# EAGLE schematic Photon_I2C_Shield (EAGLE 7.6.0)
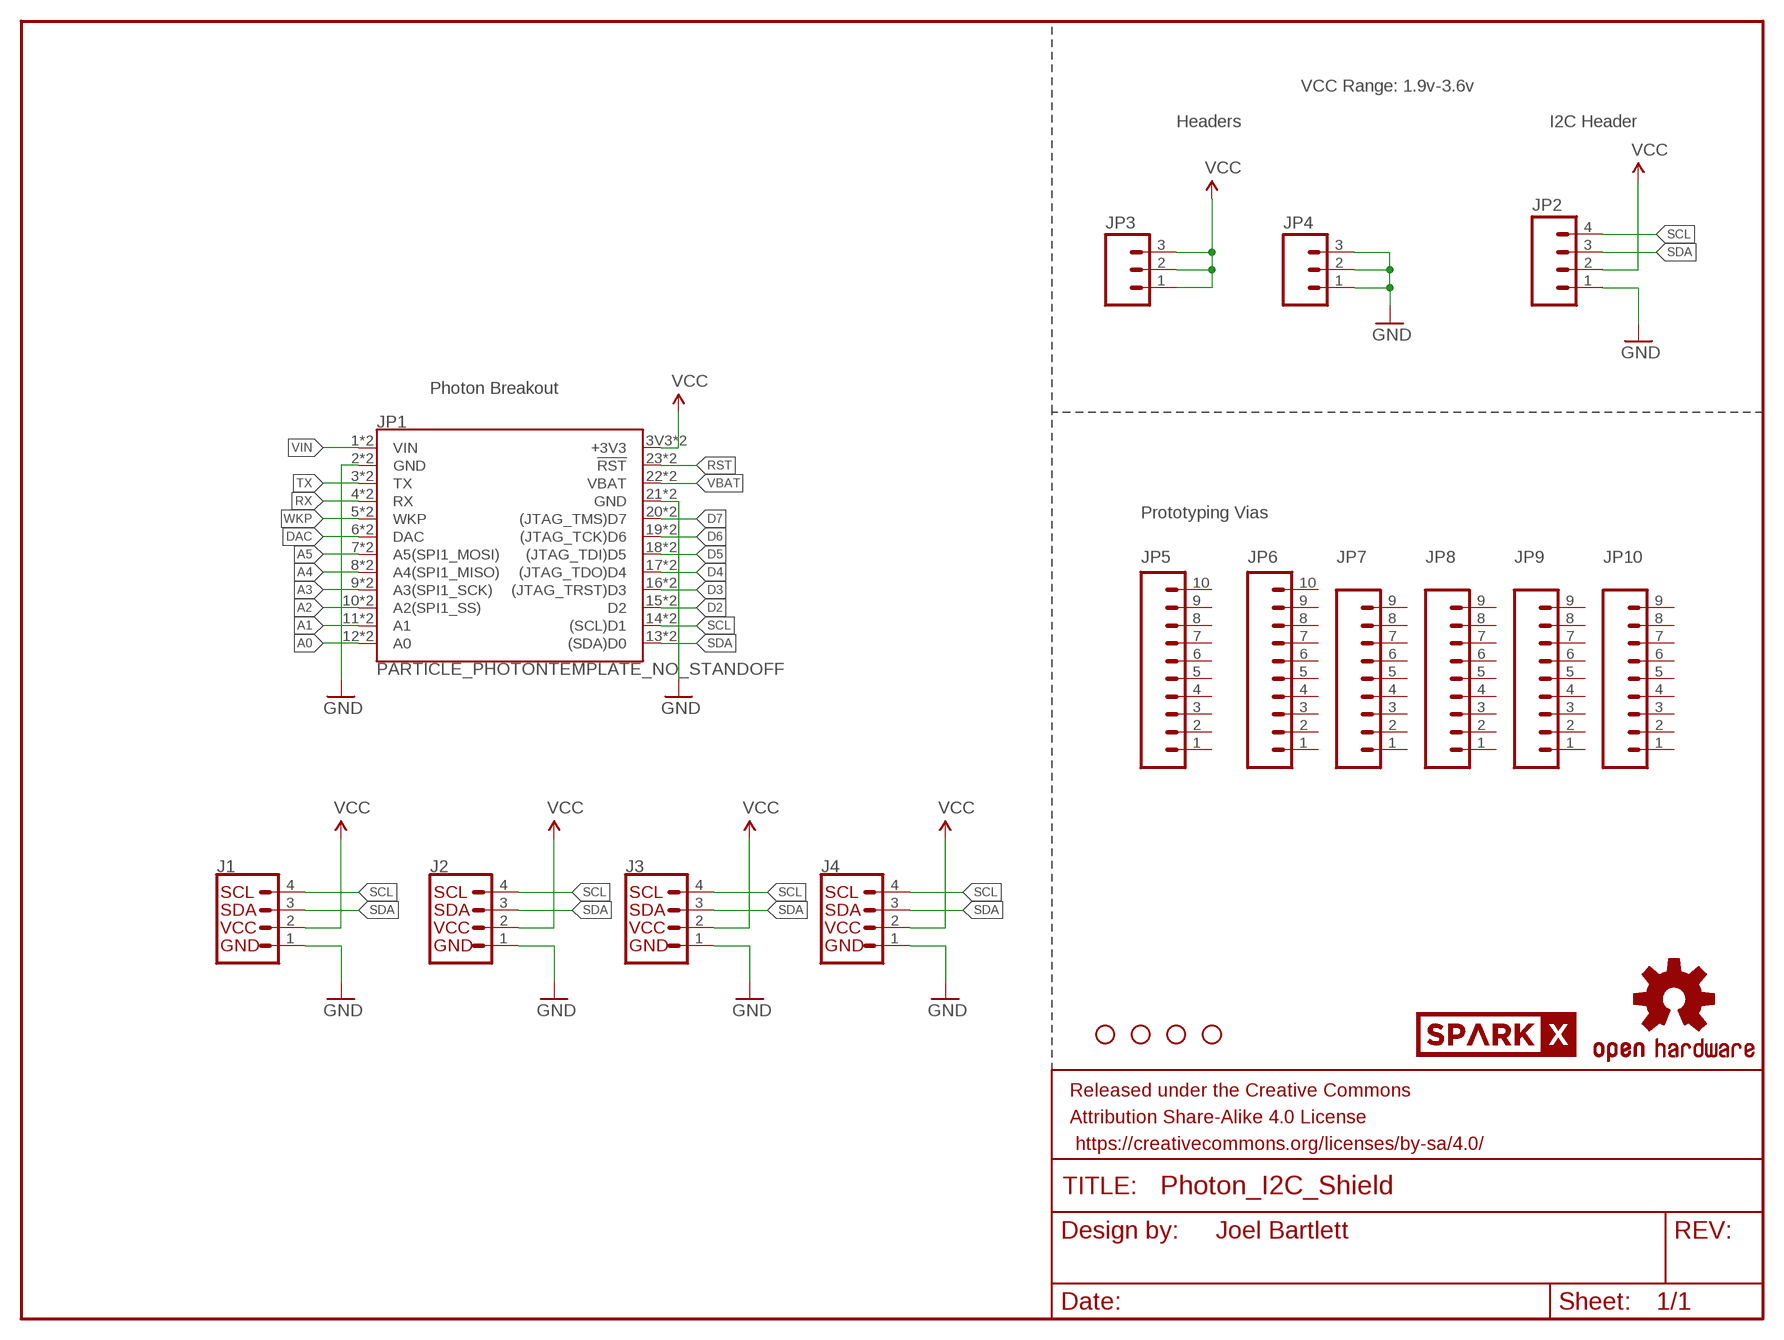
[diagram p0: schematic, sheet 1]

## Parts
FRAME1  FRAME-LETTER  [CREATIVE_COMMONS]
H1  STAND-OFF  [STAND-OFF]
H2  STAND-OFF  [STAND-OFF]
H3  STAND-OFF  [STAND-OFF]
H4  STAND-OFF  [STAND-OFF]
J1  I2C_STANDARDJS-1MM  [1X04_1MM_RA]
J2  I2C_STANDARDJS-1MM  [1X04_1MM_RA]
J3  I2C_STANDARDJS-1MM  [1X04_1MM_RA]
J4  I2C_STANDARDJS-1MM  [1X04_1MM_RA]
JP1  PARTICLE_PHOTONTEMPLATE_NO_STANDOFF  [PARTICLE_PHOTON_TEMPLATE_NO_STANDOFF]
JP2  M04PTH  [1X04]
JP3  M03PTH  [1X03]
JP4  M03PTH  [1X03]
JP5  M10NO_SILK_PTH_FEMALE  [1X10_NO_SILK]
JP6  M10NO_SILK_PTH_FEMALE  [1X10_NO_SILK]
JP7  M09NO_SILK  [1X09_NO_SILK]
JP8  M09NO_SILK  [1X09_NO_SILK]
JP9  M09NO_SILK  [1X09_NO_SILK]
JP10  M09NO_SILK  [1X09_NO_SILK]
LOGO1  OSHW-LOGOM  [OSHW-LOGO-M]
U$4  SPARKX-LOGO5  [SPARKX-LARGE]

## Nets
A0: JP1.12(A0) JP1.A0
A1: JP1.11(A1) JP1.A1
A2: JP1.10(A2(SPI1_SS)) JP1.A2(A2(SPI1_SS))
A3: JP1.9(A3(SPI1_SCK)) JP1.A3(A3(SPI1_SCK))
A4: JP1.8(A4(SPI1_MISO)) JP1.A4(A4(SPI1_MISO))
A5: JP1.7(A5(SPI1_MOSI)) JP1.A5(A5(SPI1_MOSI))
D2: JP1.15(D2) JP1.D2
D3: JP1.16((JTAG_TRST)D3) JP1.D3((JTAG_TRST)D3)
D4: JP1.17((JTAG_TDO)D4) JP1.D4((JTAG_TDO)D4)
D5: JP1.18((JTAG_TDI)D5) JP1.D5((JTAG_TDI)D5)
D6: JP1.19((JTAG_TCK)D6) JP1.D6((JTAG_TCK)D6)
D7: JP1.20((JTAG_TMS)D7) JP1.D7((JTAG_TMS)D7)
DAC: JP1.6(DAC) JP1.DAC
GND: J1.1(GND) J2.1(GND) J3.1(GND) J4.1(GND) JP1.2(GND) JP1.21(GND) JP1.GND@0(GND) JP1.GND@2(GND) JP2.1 JP4.1 JP4.2 JP4.3
RST: JP1.23(!RST!) JP1.RST(!RST!)
RX: JP1.4(RX) JP1.RX
SCL: J1.4(SCL) J2.4(SCL) J3.4(SCL) J4.4(SCL) JP1.14((SCL)D1) JP1.D1((SCL)D1) JP2.4
SDA: J1.3(SDA) J2.3(SDA) J3.3(SDA) J4.3(SDA) JP1.13((SDA)D0) JP1.D0((SDA)D0) JP2.3
TX: JP1.3(TX) JP1.TX
VBAT: JP1.22(VBAT) JP1.VBAT
VCC: J1.2(VCC) J2.2(VCC) J3.2(VCC) J4.2(VCC) JP1.3V3(+3V3) JP1.24(+3V3) JP2.2 JP3.1 JP3.2 JP3.3
VIN: JP1.1(VIN) JP1.VIN
WKP: JP1.5(WKP) JP1.WKP
Unconnected: JP5.1 JP5.2 JP5.3 JP5.4 JP5.5 JP5.6 JP5.7 JP5.8 JP5.9 JP5.10 JP6.1 JP6.2 JP6.3 JP6.4 JP6.5 JP6.6 JP6.7 JP6.8 JP6.9 JP6.10 JP7.1 JP7.2 JP7.3 JP7.4 JP7.5 JP7.6 JP7.7 JP7.8 JP7.9 JP8.1 JP8.2 JP8.3 JP8.4 JP8.5 JP8.6 JP8.7 JP8.8 JP8.9 JP9.1 JP9.2 JP9.3 JP9.4 JP9.5 JP9.6 JP9.7 JP9.8 JP9.9 JP10.1 JP10.2 JP10.3 JP10.4 JP10.5 JP10.6 JP10.7 JP10.8 JP10.9

## Notes on the sheet
- VCC Range: 1.9v-3.6v
- Headers | I2C Header
- Photon Breakout
- Prototyping Vias
- Joel Bartlett

## Library data of the parts
FRAME1 = SparkFun-Aesthetics:FRAME-LETTER: Schematic Frame - Letter Standard 8.5x11 US Letter frame
H1-H4 = SparkFun-Hardware:STAND-OFF: Stand Off Drill holes for mechanically mounting via screws, standoffs, etc. Note: Use the keepout ring to avoid running the screw head into surrounding components. Variant Overviews STAND-OFF - Mechanical footprint for a #4 phillips button head screw. STAND-OFF-TIGHT - Mechanical footprint for a #4 phillips button head screw, Example SparkFun Products Screw - Phillips Head (1/4", 4-40, 10 pack) <https://www.sparkfun.com/products/10453> (PRT-10453) Screw - Phillips Head (1/2", 4-40, 10 pack) <https://www.sparkfun.com/products/10452> (PRT-10452) Screw - Phillips Head (3/4", 4-40, 10 pack) <https://www.sparkfun.com/products/10451> (PRT-10451) Screw - Phillips Head (1", 4-40, 10 pack) <https://www.sparkfun.com/products/10450> (PRT-10450)
J1-J4 = SparkX:I2C_STANDARD: SparkFun I2C Standard Pinout Header SparkFun has standardized on a pinout for all I2C based sensor breakouts. This pinout allows I2C boards to be plugged directly into the headers on Arduino Uno compatible boards, and to be daisy chained easily. Example SparkFun Products: SparkFun Atmospheric Sensor Breakout - BME280 <https://www.sparkfun.com/products/13676> SparkFun Altitude/Pressure Sensor Breakout - MPL3115A2 <https://www.sparkfun.com/products/11084> SparkFun TOF Range Finder Sensor - VL6180 <https://www.sparkfun.com/products/12785>
JP1 = SparkFun-Boards:PARTICLE_PHOTON: Particle Photon Footprint of the Particle Photon that is used as a basis for many Photon shields. SparkFun Products: Particle Photon <https://www.sparkfun.com/products/13764> SparkFun Photon ProtoShield <https://www.sparkfun.com/products/13598> SparkFun Photon micro OLED Shield <https://www.sparkfun.com/products/13628> SparkFun Photon IMU Shield <https://www.sparkfun.com/products/13629> SparkFun Photon Battery Shield <https://www.sparkfun.com/products/13626>
JP2 = SparkFun-Connectors:M04: Header 4 Standard 4-pin 0.1" header. Use with straight break away headers (SKU : PRT-00116), right angle break away headers (PRT-00553), swiss pins (PRT-00743), machine pins (PRT-00117), and female headers (PRT-00115). Molex polarized connector foot print use with SKU : PRT-08231 with associated crimp pins and housings. 1MM SMD Version SKU: PRT-10208
JP3 JP4 = SparkFun-Connectors:M03: Header 3 Standard 3-pin 0.1" header. Use with straight break away headers (SKU : PRT-00116), right angle break away headers (PRT-00553), swiss pins (PRT-00743), machine pins (PRT-00117), and female headers (PRT-00115). Molex polarized connector foot print use with SKU : PRT-08232 with associated crimp pins and housings.
JP5 JP6 = SparkFun-Connectors:M10: Header 10 Standard 10-pin 0.1" header. Use with straight break away headers (SKU : PRT-00116), right angle break away headers (PRT-00553), swiss pins (PRT-00743), machine pins (PRT-00117), and female headers (PRT-00115).; PROD_ID: CONN-11563
JP7-JP10 = SparkFun-Connectors:M09: Header 9 Standard 9-pin 0.1" header. Use with straight break away headers (SKU : PRT-00116), right angle break away headers (PRT-00553), swiss pins (PRT-00743), machine pins (PRT-00117), and female headers (PRT-00115).
LOGO1 = SparkFun-Aesthetics:OSHW-LOGO: Open-Source Hardware (OSHW) Logo This logo indicates the piece of hardware it is found on incorporates a OSHW license and/or adheres to the definition of open source hardware found here: http://freedomdefined.org/OSHW
U$4 = SparkX:SPARKX-LOGO